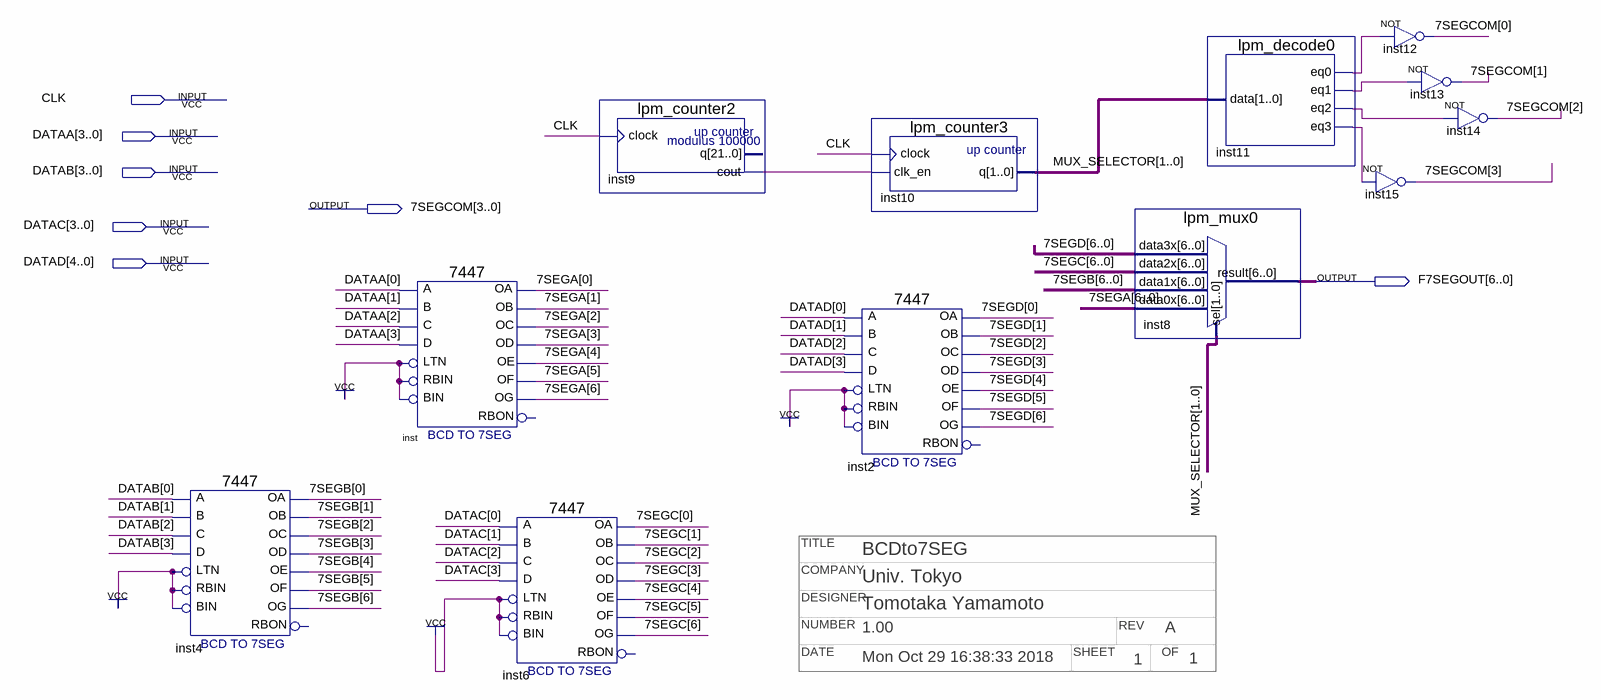
[diagram p0: schematic sheet]
// Quartus schematic a04_BCDto7SEG.bdf as structural Verilog: 12 symbols, 7 pins
// Title block: COMPANY: Univ. Tokyo; DATE: Mon Oct 29 16:38:33 2018; DESIGNER: Tomotaka Yamamoto; NUMBER: 1.00; OF: 1; REV: A; SHEET: 1; TITLE: BCDto7SEG
module a04_BCDto7SEG (
  input  CLK,
  input  [3:0] DATAA,
  input  [3:0] DATAB,
  input  [3:0] DATAC,
  input  [4:0] DATAD,
  output [3:0] \7SEGCOM ,
  output [6:0] F7SEGOUT
);

  wire inst9_cout, inst11_eq0, inst11_eq1, inst11_eq2, inst11_eq3;
  wire [1:0] MUX_SELECTOR;
  wire [6:0] \7SEGA , \7SEGB , \7SEGC , \7SEGD ;

  \7447  inst4 (
    .LTN(1'b1), .B(DATAB[1]), .C(DATAB[2]), .D(DATAB[3]), .RBIN(1'b1), .BIN(1'b1), .A(DATAB[0]),
    .OB(\7SEGB [1]), .OC(\7SEGB [2]), .OE(\7SEGB [4]), .OD(\7SEGB [3]), .OF(\7SEGB [5]), .OG(\7SEGB [6]),
    .OA(\7SEGB [0]));  // open: RBON
  \7447  inst (
    .LTN(1'b1), .B(DATAA[1]), .C(DATAA[2]), .D(DATAA[3]), .RBIN(1'b1), .BIN(1'b1), .A(DATAA[0]),
    .OB(\7SEGA [1]), .OC(\7SEGA [2]), .OE(\7SEGA [4]), .OD(\7SEGA [3]), .OF(\7SEGA [5]), .OG(\7SEGA [6]),
    .OA(\7SEGA [0]));  // open: RBON
  \7447  inst6 (
    .LTN(1'b1), .B(DATAC[1]), .C(DATAC[2]), .D(DATAC[3]), .RBIN(1'b1), .BIN(1'b1), .A(DATAC[0]),
    .OB(\7SEGC [1]), .OC(\7SEGC [2]), .OE(\7SEGC [4]), .OD(\7SEGC [3]), .OF(\7SEGC [5]), .OG(\7SEGC [6]),
    .OA(\7SEGC [0]));  // open: RBON
  lpm_counter2 inst9 (.clock(CLK), .cout(inst9_cout));  // open: q
  \7447  inst2 (
    .LTN(1'b1), .B(DATAD[1]), .C(DATAD[2]), .D(DATAD[3]), .RBIN(1'b1), .BIN(1'b1), .A(DATAD[0]),
    .OB(\7SEGD [1]), .OC(\7SEGD [2]), .OE(\7SEGD [4]), .OD(\7SEGD [3]), .OF(\7SEGD [5]), .OG(\7SEGD [6]),
    .OA(\7SEGD [0]));  // open: RBON
  lpm_counter3 inst10 (.clock(CLK), .clk_en(inst9_cout), .q(MUX_SELECTOR));
  lpm_mux0 inst8 (
    .data3x(\7SEGD ), .data2x(\7SEGC ), .data1x(\7SEGB ), .data0x(\7SEGA ), .sel(MUX_SELECTOR),
    .result(F7SEGOUT));
  lpm_decode0 inst11 (.data(MUX_SELECTOR), .eq0(inst11_eq0), .eq1(inst11_eq1), .eq2(inst11_eq2), .eq3(inst11_eq3));
  not inst15 (\7SEGCOM [3], inst11_eq3);
  not inst12 (\7SEGCOM [0], inst11_eq0);
  not inst13 (\7SEGCOM [1], inst11_eq1);
  not inst14 (\7SEGCOM [2], inst11_eq2);
endmodule
